# EAGLE schematic EMC03-MCU (EAGLE 7.4.0)

## Sheet 1 of 2
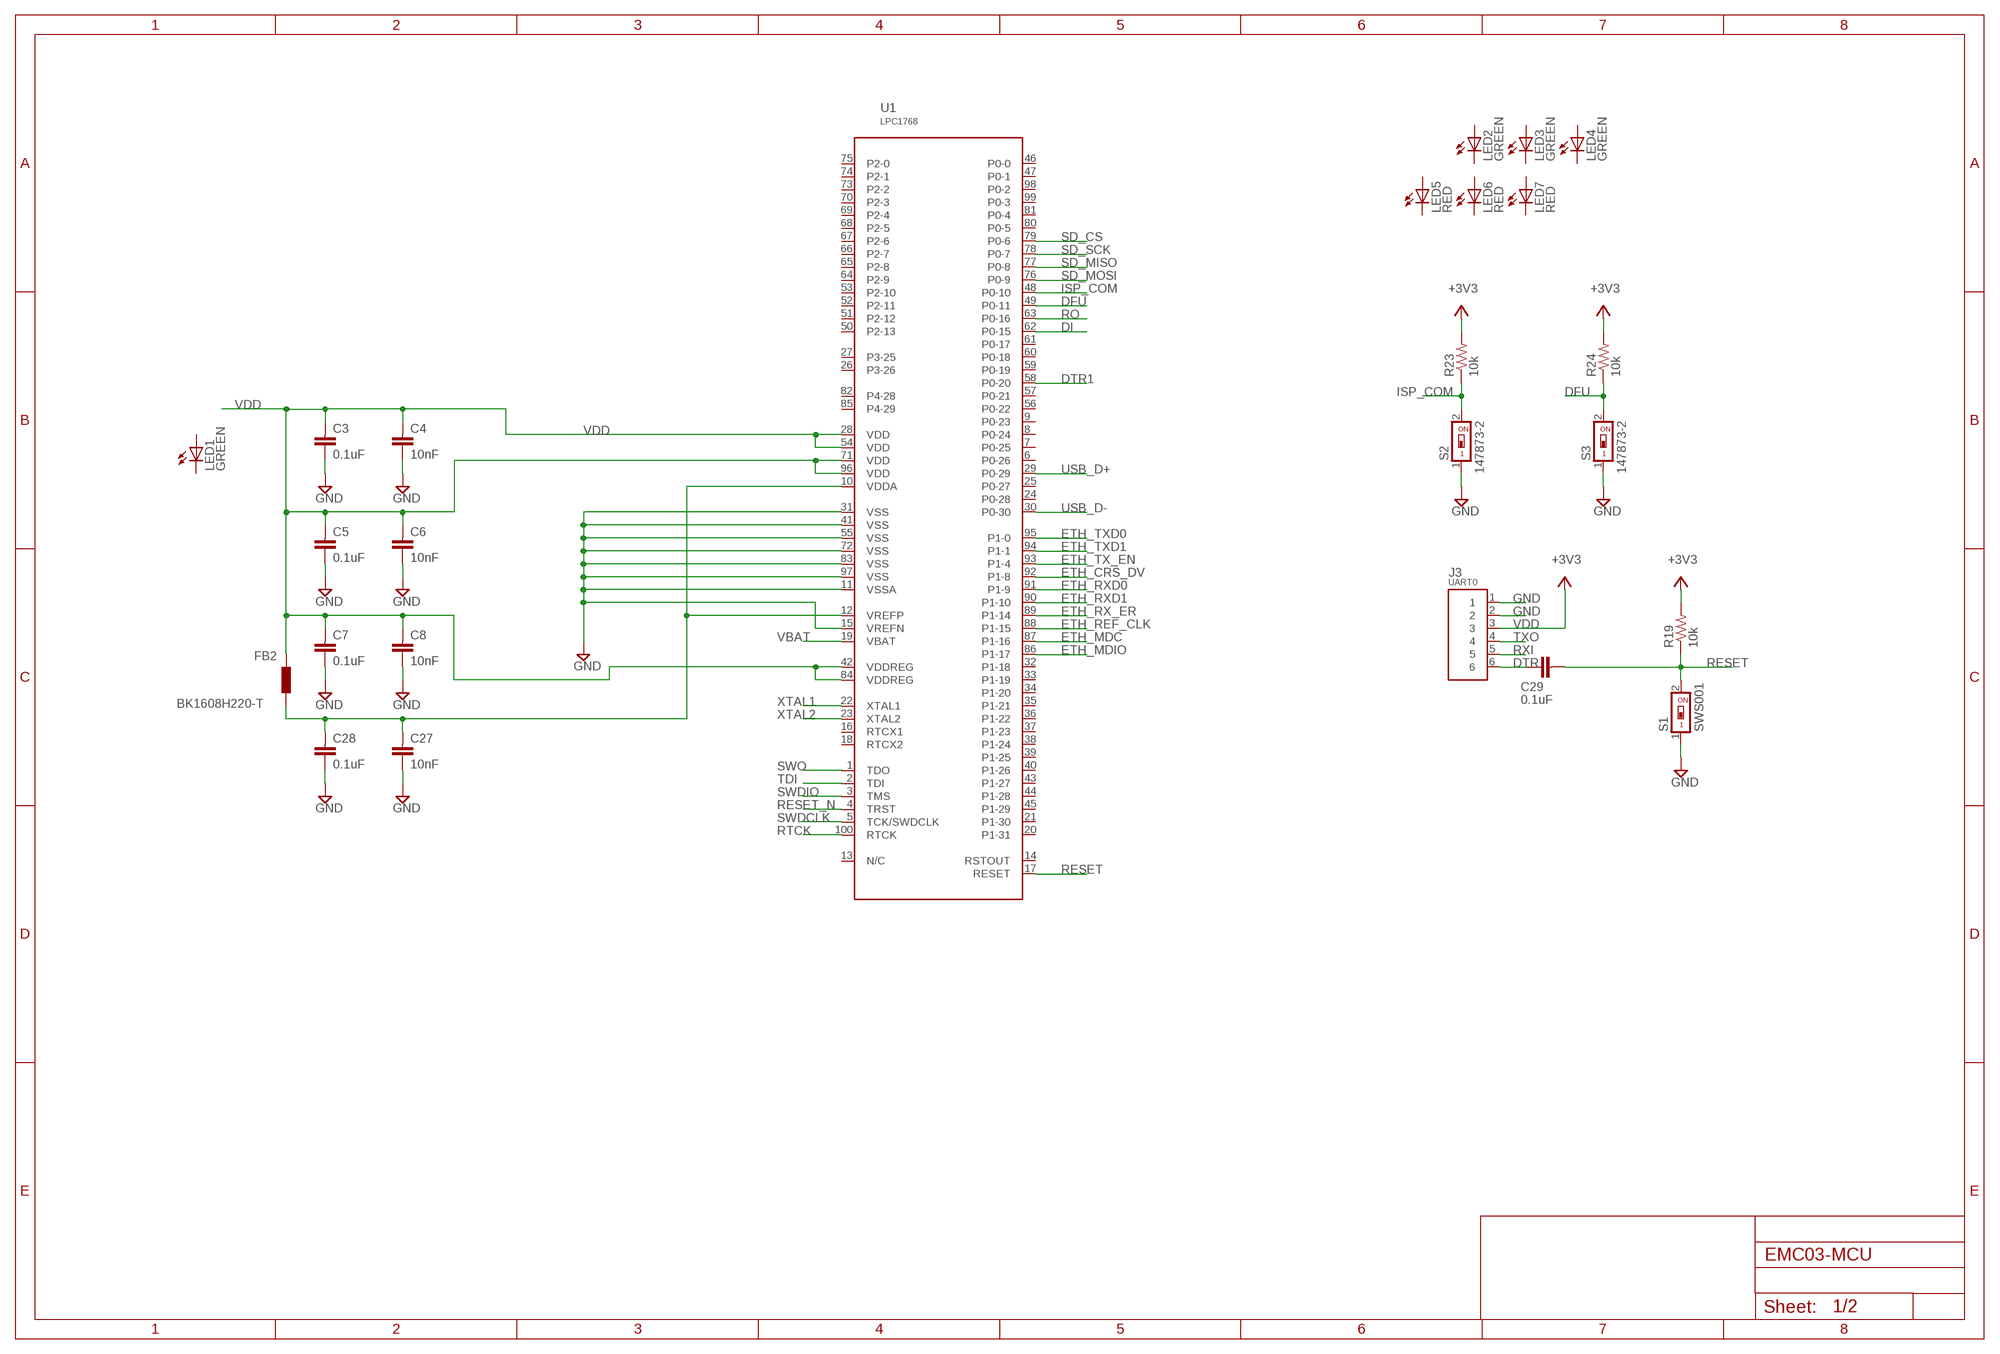
[diagram p0: schematic, sheet 1]

### Parts
C3  0.1uF  CPL-CAP-X5R-0603-0.1UF-35V  [C0603]
C4  10nF  CPL-CAP-X7R-10NF-16V  [C0603]
C5  0.1uF  CPL-CAP-X5R-0603-0.1UF-35V  [C0603]
C6  10nF  CPL-CAP-X7R-10NF-16V  [C0603]
C7  0.1uF  CPL-CAP-X5R-0603-0.1UF-35V  [C0603]
C8  10nF  CPL-CAP-X7R-10NF-16V  [C0603]
C27  10nF  CPL-CAP-X7R-10NF-16V  [C0603]
C28  0.1uF  CPL-CAP-X5R-0603-0.1UF-35V  [C0603]
C29  0.1uF  CPL-CAP-X7R-0603-0.1UF-35V  [C0603]
FB2  BK1608H220-T  BLM15HBK1608H220-T0603  [F0603]
J3  UART0  CPL-CON-HEADER-0.1IN-6P-M  [CON-HDR-6POS-MALE]
LED1  GREEN  CPL-LED-0603-GREEN  [LED0603]
LED2  GREEN  CPL-LED-0603-GREEN  [LED0603]
LED3  GREEN  CPL-LED-0603-GREEN  [LED0603]
LED4  GREEN  CPL-LED-0603-GREEN  [LED0603]
LED5  RED  CPL-LED-0603-RED  [LED0603]
LED6  RED  CPL-LED-0603-RED  [LED0603]
LED7  RED  CPL-LED-0603-RED  [LED0603]
R19  10k  CPL-RES-0603-10K-0.1W  [R0603]
R23  10k  CPL-RES-0603-10K-0.1W  [R0603]
R24  10k  CPL-RES-0603-10K-0.1W  [R0603]
S1  SWS001  [SMS-001]
S2  147873-2  CPL-SW-MOM-0603  [0603]
S3  147873-2  CPL-SW-MOM-0603  [0603]
U1  LPC1768  LPC1768LQFP-100  [LQFP-100]

### Nets
+3V3: J3.3 R19.2 R23.2 R24.2 ; also sheet 2
DFU: R24.1 S3.2 U1.49(P0-11)
DI: U1.62(P0-15) ; also sheet 2
DTR: C29.1 J3.6
DTR1: U1.58(P0-20) ; also sheet 2
ETH_CRS_DV: U1.92(P1-8) ; also sheet 2
ETH_MDC: U1.87(P1-16) ; also sheet 2
ETH_MDIO: U1.86(P1-17) ; also sheet 2
ETH_REF_CLK: U1.88(P1-15) ; also sheet 2
ETH_RX_ER: U1.89(P1-14) ; also sheet 2
ETH_RXD0: U1.91(P1-9) ; also sheet 2
ETH_RXD1: U1.90(P1-10) ; also sheet 2
ETH_TX_EN: U1.93(P1-4) ; also sheet 2
ETH_TXD0: U1.95(P1-0) ; also sheet 2
ETH_TXD1: U1.94(P1-1) ; also sheet 2
GND: C3.1 C4.1 C5.1 C6.1 C7.1 C8.1 C28.1 J3.1 J3.2 S1.1 S2.1 S3.1 U1.11(VSSA) U1.15(VREFN) U1.31(VSS) U1.41(VSS) U1.55(VSS) U1.72(VSS) U1.83(VSS) U1.97(VSS) ; also sheet 2
GND1: C27.1
ISP_COM: R23.1 S2.2 U1.48(P0-10)
N$2: C27.2 C28.2 FB2.1 U1.10(VDDA) U1.12(VREFP)
RESET: C29.2 R19.1 S1.2 U1.17(RESET)
RESET_N: U1.4(TRST) ; also sheet 2
RO: U1.63(P0-16) ; also sheet 2
RTCK: U1.100(RTCK) ; also sheet 2
RXI: J3.5
SD_CS: U1.79(P0-6) ; also sheet 2
SD_MISO: U1.77(P0-8) ; also sheet 2
SD_MOSI: U1.76(P0-9) ; also sheet 2
SD_SCK: U1.78(P0-7) ; also sheet 2
SWDCLK: U1.5(TCK/SWDCLK) ; also sheet 2
SWDIO: U1.3(TMS) ; also sheet 2
SWO: U1.1(TDO) ; also sheet 2
TDI: U1.2(TDI) ; also sheet 2
TXO: J3.4
USB_D+: U1.29(P0-29) ; also sheet 2
USB_D-: U1.30(P0-30) ; also sheet 2
VBAT: U1.19(VBAT)
VDD: C3.2 C4.2 C5.2 C6.2 C7.2 C8.2 FB2.2 U1.28(VDD) U1.42(VDDREG) U1.54(VDD) U1.71(VDD) U1.84(VDDREG) U1.96(VDD)
XTAL1: U1.22(XTAL1) ; also sheet 2
XTAL2: U1.23(XTAL2) ; also sheet 2
Unconnected: LED1.A LED1.C LED2.A LED2.C LED3.A LED3.C LED4.A LED4.C LED5.A LED5.C LED6.A LED6.C LED7.A LED7.C U1.6(P0-26) U1.7(P0-25) U1.8(P0-24) U1.9(P0-23) U1.13(N/C) U1.14(RSTOUT) U1.16(RTCX1) U1.18(RTCX2) U1.20(P1-31) U1.21(P1-30) U1.24(P0-28) U1.25(P0-27) U1.26(P3-26) U1.27(P3-25) U1.32(P1-18) U1.33(P1-19) U1.34(P1-20) U1.35(P1-21) U1.36(P1-22) U1.37(P1-23) U1.38(P1-24) U1.39(P1-25) U1.40(P1-26) U1.43(P1-27) U1.44(P1-28) U1.45(P1-29) U1.46(P0-0) U1.47(P0-1) U1.50(P2-13) U1.51(P2-12) U1.52(P2-11) U1.53(P2-10) U1.56(P0-22) U1.57(P0-21) U1.59(P0-19) U1.60(P0-18) U1.61(P0-17) U1.64(P2-9) U1.65(P2-8) U1.66(P2-7) U1.67(P2-6) U1.68(P2-5) U1.69(P2-4) U1.70(P2-3) U1.73(P2-2) U1.74(P2-1) U1.75(P2-0) U1.80(P0-5) U1.81(P0-4) U1.82(P4-28) U1.85(P4-29) U1.98(P0-2) U1.99(P0-3)

### Notes on the sheet
- VDD

## Sheet 2 of 2
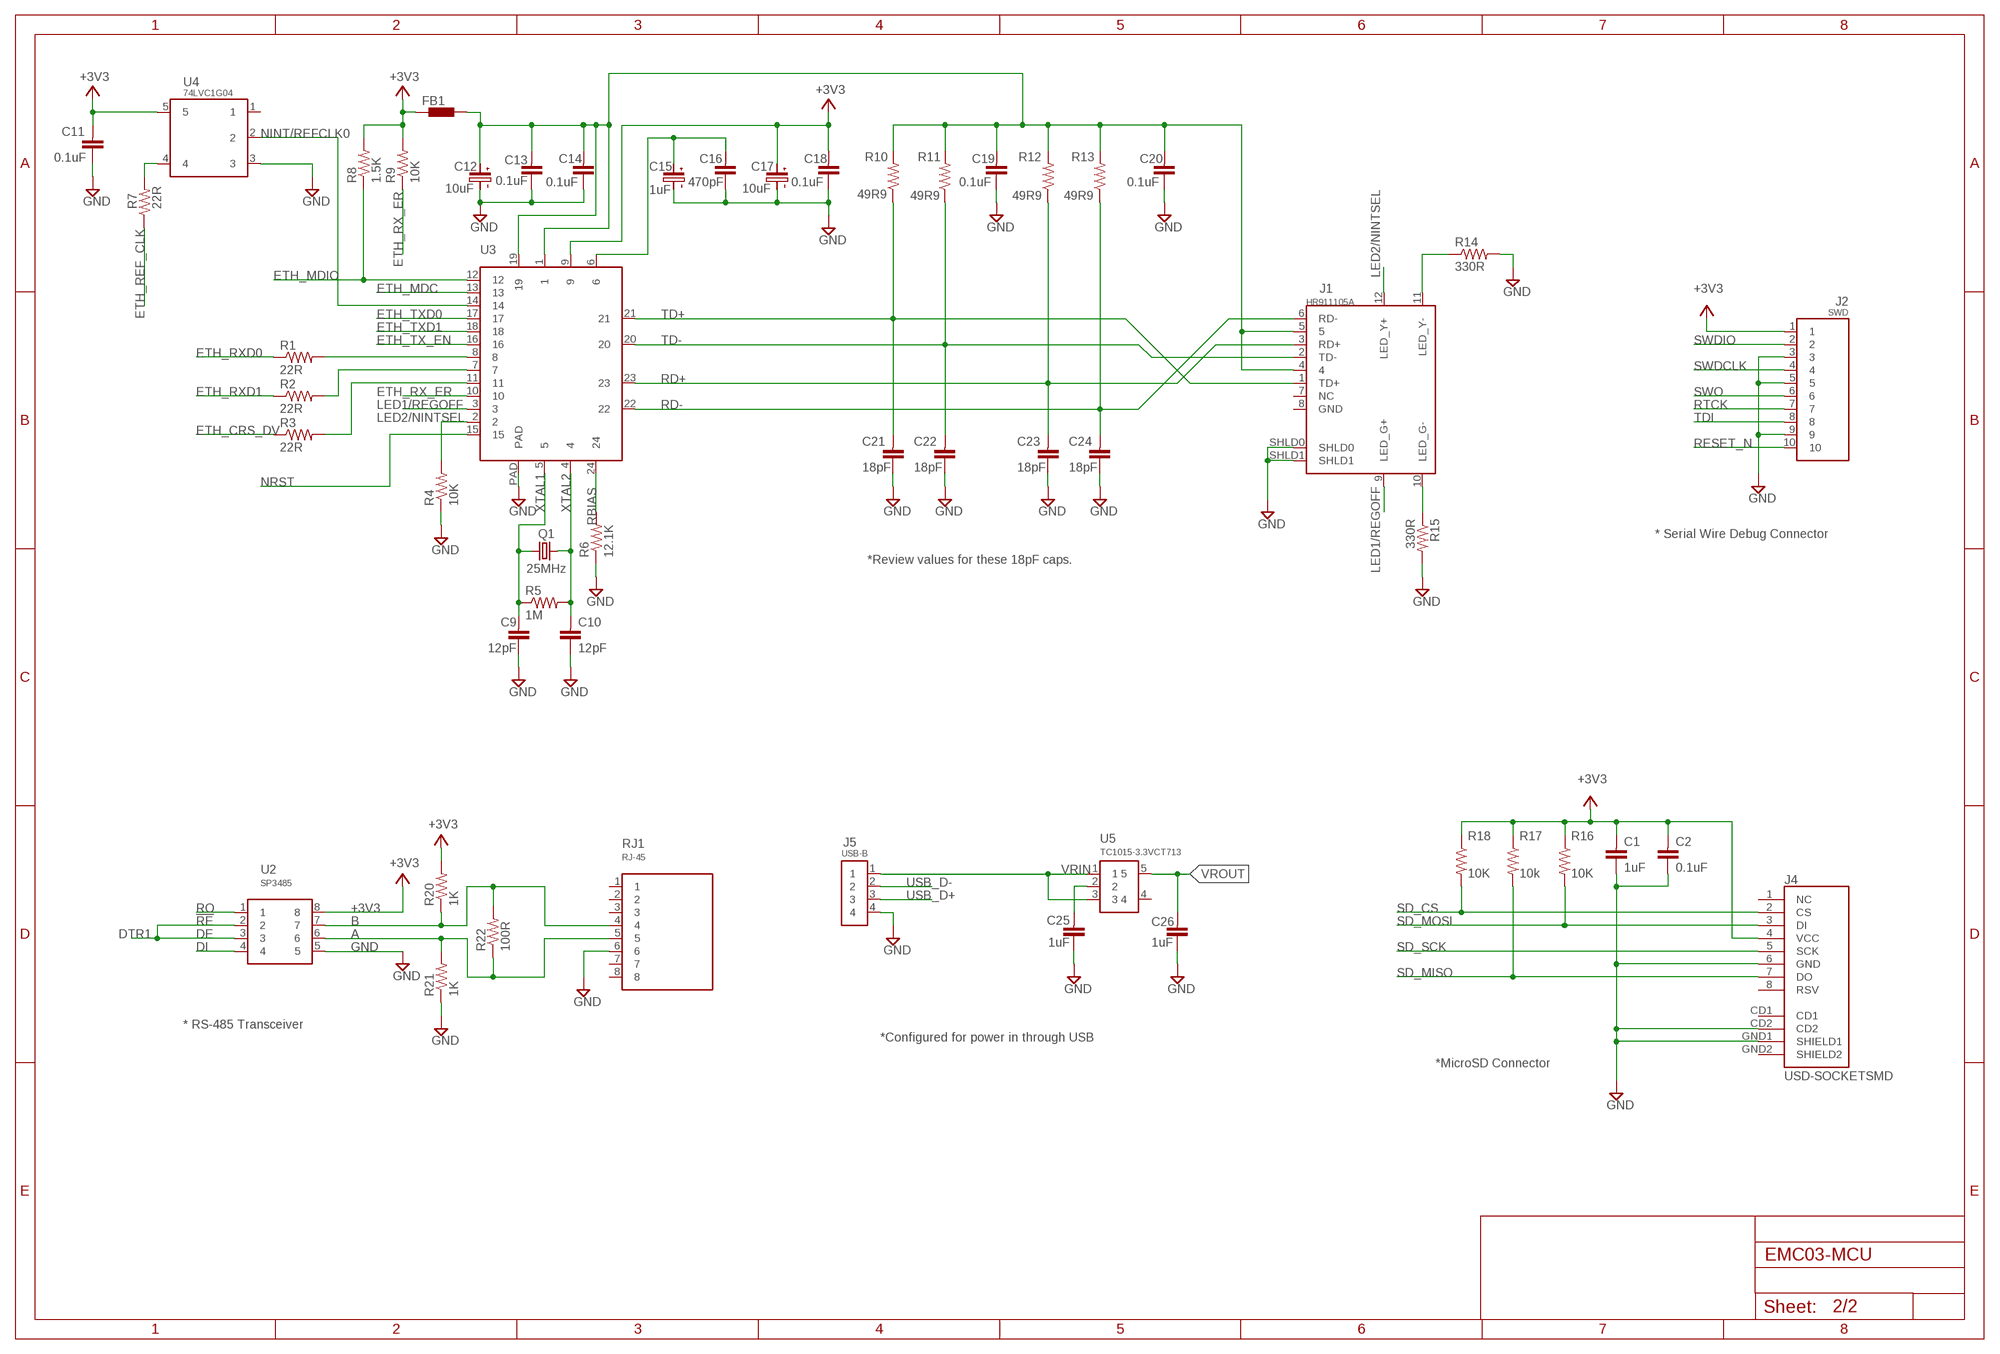
[diagram p1: schematic, sheet 2]

### Parts
C1  1uF  CPL-CAP-X5R-0603-1UF-50V  [C0603]
C2  0.1uF  CPL-CAP-X5R-0603-0.1UF-35V  [C0603]
C9  12pF  CPL-CAP-C0G-0603-12PF-50V  [C0603]
C10  12pF  CPL-CAP-C0G-0603-12PF-50V  [C0603]
C11  0.1uF  CPL-CAP-X5R-0603-0.1UF-35V  [C0603]
C12  10uF  CPL-CAP-ALU-RAD-10UF-50V  [C-RAD-6.3MM]
C13  0.1uF  CPL-CAP-X7R-0603-0.1UF-35V  [C0603]
C14  0.1uF  CPL-CAP-X7R-0603-0.1UF-35V  [C0603]
C15  1uF  CPL-CAP-ALU-SMD-1UF-50V  [C-SMD-4MM]
C16  470pF  CPL-CAP-X7R-0603-470PF-100V  [C0603]
C17  10uF  CPL-CAP-ALU-RAD-10UF-50V  [C-RAD-6.3MM]
C18  0.1uF  CPL-CAP-X7R-0603-0.1UF-35V  [C0603]
C19  0.1uF  CPL-CAP-X7R-0603-0.1UF-35V  [C0603]
C20  0.1uF  CPL-CAP-X7R-0603-0.1UF-35V  [C0603]
C21  18pF  CPL-CAP-C0G-0603-18PF-50V  [C0603]
C22  18pF  CPL-CAP-C0G-0603-18PF-50V  [C0603]
C23  18pF  CPL-CAP-C0G-0603-18PF-50V  [C0603]
C24  18pF  CPL-CAP-C0G-0603-18PF-50V  [C0603]
C25  1uF  CPL-CAP-X5R-0603-1UF-50V  [C0603]
C26  1uF  CPL-CAP-X5R-0603-1UF-50V  [C0603]
FB1  BLM15HBK1608H220-T0603  [F0603]
J1  HR911105A  CPL-ETH-MACJACK-LED-SHLD  [MAGJACK(HR911105A)]
J2  SWD  CPL-CON-HEADER-0.05IN-10P-M  [FTSH-105-01-XXX-DV-K]
J4  USD-SOCKETSMD  [MICRO-SD-SOCKET-PP]
J5  USB-B  CPL-CON-USB-B  [USB-B(THRU)]
Q1  25MHz  CPL-OSC-CRY-25MHZ-18PF  [HC-49/U-S]
R1  22R  CPL-RES-0603-22R-0.1W  [R0603]
R2  22R  CPL-RES-0603-22R-0.1W  [R0603]
R3  22R  CPL-RES-0603-22R-0.1W  [R0603]
R4  10K  CPL-RES-0603-10K-0.1W  [R0603]
R5  1M  CPL-RES-0603-1M-0.1W  [R0603]
R6  12.1K  CPL-RES-0603-12.1K-0.1W  [R0603]
R7  22R  CPL-RES-0603-22R-0.1W  [R0603]
R8  1.5K  CPL-RES-0603-1.5K-50V  [R0603]
R9  10K  CPL-RES-0603-10K-0.1W  [R0603]
R10  49R9  CPL-RES-0603-49.9-0.1W  [R0603]
R11  49R9  CPL-RES-0603-49.9-0.1W  [R0603]
R12  49R9  CPL-RES-0603-49.9-0.1W  [R0603]
R13  49R9  CPL-RES-0603-49.9-0.1W  [R0603]
R14  330R  CPL-RES-0603-330-0.1W  [R0603]
R15  330R  CPL-RES-0603-330-0.1W  [R0603]
R16  10K  CPL-RES-0603-10K-0.1W  [R0603]
R17  10k  CPL-RES-0603-10K-0.1W  [R0603]
R18  10K  CPL-RES-0603-10K-0.1W  [R0603]
R20  1K  CPL-RES-0603-1K-0.1W  [R0603]
R21  1K  CPL-RES-0603-1K-0.1W  [R0603]
R22  100R  CPL-RES-0603-100-0.1W  [R0603]
RJ1  RJ-45  CPL-CON-MOD-RJ45  [CON-RJ45]
U2  SP3485  [SOICN-8]
U3  CPL-ETH-PHY-LAN8720A  [QFN-24]
U4  74LVC1G04  CPL-INV-SOT25-5.5V-3.3V  [SOT-25]
U5  TC1015-3.3VCT713  CPL-REG-LIN-3.3V-0.1A  [SOT-23-5]

### Nets
+3V3: C1.2 C2.2 C11.2 C17.POS C18.2 FB1.1 J2.1 J4.4(VCC) R8.2 R9.2 R16.1 R17.1 R18.1 R20.2 U2.8 U3.9 U4.5 ; also sheet 1
A: R21.2 R22.1 RJ1.5 U2.6
B: R20.1 R22.2 RJ1.4 U2.7
DI: U2.4 ; also sheet 1
DTR1: U2.2 U2.3 ; also sheet 1
ETH_CRS_DV: R3.1 ; also sheet 1
ETH_MDC: U3.13 ; also sheet 1
ETH_MDIO: R8.1 U3.12 ; also sheet 1
ETH_REF_CLK: R7.1 ; also sheet 1
ETH_RX_ER: R9.1 U3.10 ; also sheet 1
ETH_RXD0: R1.1 ; also sheet 1
ETH_RXD1: R2.1 ; also sheet 1
ETH_TX_EN: U3.16 ; also sheet 1
ETH_TXD0: U3.17 ; also sheet 1
ETH_TXD1: U3.18 ; also sheet 1
GND: C1.1 C2.1 C9.1 C10.1 C11.1 C12.NEG C13.1 C14.1 C15.NEG C16.1 C17.NEG C18.1 C19.1 C20.1 C21.1 C22.1 C23.1 C24.1 C25.1 C26.1 J1.SHLD0 J1.SHLD1 J2.3 J2.5 J2.9 J4.6(GND) J4.CD2 J4.GND1(SHIELD1) J5.4 R4.1 R6.1 R14.2 R15.2 R21.1 RJ1.6 U2.5 U3.PAD U4.3 ; also sheet 1
LED1/REGOFF: J1.9(LED_G+) U3.3
LED2/NINTSEL: J1.12(LED_Y+) R4.2 U3.2
N$3: J1.11(LED_Y-) R14.1
N$4: J1.10(LED_G-) R15.1
N$16: R1.2 U3.8
N$17: C25.2 U5.2
N$18: R2.2 U3.7
N$19: R3.2 U3.11
N$21: R7.2 U4.4
N$22: C12.POS C13.2 C14.2 C19.2 C20.2 FB1.2 J1.4 J1.5 R10.2 R11.2 R12.2 R13.2 U3.1 U3.19
N$23: C15.POS C16.2 U3.6
NINT/REFCLK0: U3.14 U4.2
NRST: U3.15
RBIAS: R6.2 U3.24
RD+: C23.2 J1.3(RD+) R12.1 U3.23
RD-: C24.2 J1.6(RD-) R13.1 U3.22
RESET_N: J2.10 ; also sheet 1
RO: U2.1 ; also sheet 1
RTCK: J2.7 ; also sheet 1
SD_CS: J4.2(CS) R18.2 ; also sheet 1
SD_MISO: J4.7(DO) R17.2 ; also sheet 1
SD_MOSI: J4.3(DI) R16.2 ; also sheet 1
SD_SCK: J4.5(SCK) ; also sheet 1
SWDCLK: J2.4 ; also sheet 1
SWDIO: J2.2 ; also sheet 1
SWO: J2.6 ; also sheet 1
TD+: C21.2 J1.1(TD+) R10.1 U3.21
TD-: C22.2 J1.2(TD-) R11.1 U3.20
TDI: J2.8 ; also sheet 1
USB_D+: J5.3 ; also sheet 1
USB_D-: J5.2 ; also sheet 1
VRIN: J5.1 U5.1 U5.3
VROUT: C26.2 U5.5
XTAL1: C9.2 Q1.1 R5.1 U3.5 ; also sheet 1
XTAL2: C10.2 Q1.2 R5.2 U3.4 ; also sheet 1
Unconnected: J1.7(NC) J1.8(GND) J4.1(NC) J4.8(RSV) J4.CD1 J4.GND2(SHIELD2) RJ1.1 RJ1.2 RJ1.3 RJ1.7 RJ1.8 U4.1 U5.4

### Notes on the sheet
- * Serial Wire Debug Connector
- *Review values for these 18pF caps.
- !RE
- DE
- * RS-485 Transceiver
- *Configured for power in through USB
- *MicroSD Connector

## Library data of the parts
C1 C25 C26 = TinWhiskers:CPL-CAP-X5R-0603-1UF-50V: Capacitor: 0.1uF, 50V, 10%; Package: 0603; Datasheet: http://www.mouser.com/ds/2/396/mlcc_all_e-541559.pdf
C2 C3 C5 C7 C11 C28 = TinWhiskers:CPL-CAP-X5R-0603-0.1UF-35V: Capacitor: 0.1uF, 35V, 10%, X5R; Package: 0603; Datasheet: http://www.yuden.co.jp/productdata/catalog/en/mlcc01_hq_e.pdf
C4 C6 C8 C27 = TinWhiskers:CPL-CAP-X7R-10NF-16V: Capacitor: 10nF(0.01uF), 16V, 5%; Package: 0603; Datasheet: http://www.mouser.com/ds/2/396/mlcc_all_e-541559.pdf
C9 C10 = TinWhiskers:CPL-CAP-C0G-0603-12PF-50V: Capacitor: 12pF, 50V, 5%; Package: 0603; Datasheet: http://download.siliconexpert.com/pdfs/2011/4/6/10/1/57/701/samelm_/manual/cl10c120jb8nnnc.pdf
C12 C17 = TinWhiskers:CPL-CAP-ALU-RAD-10UF-50V
C13 C14 C18-C20 C29 = TinWhiskers:CPL-CAP-X7R-0603-0.1UF-35V: Capacitor: 0.1uF, 35V, 10%, X7R; Package: 0603; Datasheet: http://www.yuden.co.jp/productdata/catalog/en/mlcc01_hq_e.pdf
C15 = TinWhiskers:CPL-CAP-ALU-SMD-1UF-50V: Capacitor, Al-Electrolytic: 1uF, 50v, 20%; Package: 4mm Barrel (SMD); Datasheet: http://www.mouser.com/ds/2/212/KEM_A4001_EDK-535350.pdf
C16 = TinWhiskers:CPL-CAP-X7R-0603-470PF-100V: Capacitor: 470pF, 100V, 5%; Package: 0603 Datasheet: http://www.mouser.com/ds/2/427/vjw1bcbascomseries-223529.pdf
C21-C24 = TinWhiskers:CPL-CAP-C0G-0603-18PF-50V: Capacitor: 18pF, 50V, 5%; Package: 0603; Datasheet: http://www.mouser.com/ds/2/427/vjw1bcbascomseries-223529.pdf
FB1 FB2 = TinWhiskers:BLM15H: EMIFIL (R) Chip Ferrite Bead for GHz Noise Source: http://www.murata.com/ Ferrite Bead BLM15H.pdf
J1 = TinWhiskers:CPL-ETH-MACJACK-LED-SHLD: Connector: Ethernet, MagJack, RJ-45, Status LEDs+Shield; Datasheet: http://www.kosmodrom.com.ua/pdf/HR911105A.pdf
J2 = TinWhiskers:CPL-CON-HEADER-0.05IN-10P-M
J3 = TinWhiskers:CPL-CON-HEADER-0.1IN-6P-M: Connector: Header, 0.1"-Pitch, 6-Pos, Pins (Male)
J4 = TinWhiskers:USD-SOCKET: microSD Socket Push-push type uSD socket. Schematic element and footprint production proven. Spark Fun Electronics SKU : PRT-00127. tDoc lines correctly indicate media card edge positions when inserting (unlocked, locked, depressed).
J5 = TinWhiskers:CPL-CON-USB-B: Connector: USB, B-type
LED1-LED4 = TinWhiskers:CPL-LED-0603-GREEN: LED: Green; Package: 0603
LED5-LED7 = TinWhiskers:CPL-LED-0603-RED: LED: Red; Package: 0603
Q1 = TinWhiskers:CPL-OSC-CRY-25MHZ-18PF: Crystal Oscillator: 25MHz, 18pF, 30PPM; Package: HC-49/U-S; Datasheet: http://www.mouser.com/ds/2/77/HCM49-5106.pdf
R1-R3 R7 = TinWhiskers:CPL-RES-0603-22R-0.1W: Resistor, 22 Ohm, 0.1W, 10%; Package: 0603
R4 R9 R16-R19 R23 R24 = TinWhiskers:CPL-RES-0603-10K-0.1W: Resistor: 10kOhm, 0.1W, 1%; Package: 0603; Datasheet: http://www.mouser.com/ds/2/315/AOA0000CE2-37512.pdf
R5 = TinWhiskers:CPL-RES-0603-1M-0.1W: Resistor: 1MOhm, 0.1W, 5%; Package: 0603; Datasheet: http://www.samsungsem.com/global/support/library/product-catalog/__icsFiles/afieldfile/2015/01/12/CHIP_RESISTOR_150112_1.pdf
R6 = TinWhiskers:CPL-RES-0603-12.1K-0.1W: Resistor: 12.1 kOhm, 0.1W, 1%; Package: 0603; Datasheet: http://www.samsungsem.com/global/support/library/product-catalog/__icsFiles/afieldfile/2015/01/12/CHIP_RESISTOR_150112_1.pdf
R8 = TinWhiskers:CPL-RES-0603-1.5K-50V: Resistor: 1.5KOhm, 0.1W, 5%; Package: 0603; Datasheet: http://www.mouser.com/ds/2/427/dcrcwe3-109170.pdf
R10-R13 = TinWhiskers:CPL-RES-0603-49.9-0.1W: Resistor: 49.9Ohms, 0.1W, 1%; Package: 0603; Datasheet: http://www.mouser.com/ds/2/219/RN73H-12200.pdf
R14 R15 = TinWhiskers:CPL-RES-0603-330-0.1W: Resistor: 330Ohm, 0.1W, 5%; Package: 0603; Datasheet: http://www.mouser.com/ds/2/427/dcrcwe3-109170.pdf
R20 R21 = TinWhiskers:CPL-RES-0603-1K-0.1W
R22 = TinWhiskers:CPL-RES-0603-100-0.1W: Resistor: 100 Ohm, 0.1W, 1%; Package: 0603;
RJ1 = TinWhiskers:CPL-CON-MOD-RJ45: Connector: Modular Jack (RJ-45); Datasheet: http://www.farnell.com/cad/1859325.pdf
S1 = smd-special:SWS001: SMD Dip Switch 1 pol.
S2 S3 = TinWhiskers:CPL-SW-MOM-0603: Switch: Push-button, Mom.; Package: 0603
U1 = TinWhiskers:LPC1768: Microprocessor: ARM Cortex-M3 Mfr: NXP Semiconductors; Package: LQFP-100; Datasheet: http://www.nxp.com/documents/data_sheet/LPC1769_68_67_66_65_64_63.pdf
U2 = TinWhiskers:SP3485: Transceiver: RS-485 Chip; Package: SOICN-8; Datasheet: http://www.exar.com/common/content/document.ashx?id=639
U3 = TinWhiskers:CPL-ETH-PHY-LAN8720A: Physical Ethernet Chip; Package: QFN-24; Datasheet: http://ww1.microchip.com/downloads/en/DeviceDoc/8720a.pdf
U4 = TinWhiskers:CPL-INV-SOT25-5.5V-3.3V: Single Inverter; Package: SOT-25; Datasheet: http://www.mouser.com/ds/2/115/74LVC1G04-72218.pdf
U5 = TinWhiskers:CPL-REG-LIN-3.3V-0.1A: Voltage Regulator: Linear, Vmax=6, Vout=3.3V, Io=0.1mA; Package: SOT-23-5 Datasheet: http://www.mouser.com/ds/2/268/21335b-29125.pdf